# Altium schematic sheet USB_RC522_CARD_RW.SchDoc: USB RC522 Card Reader Writer
size A3; Author: eldar6776@hotmail.com; DrawnBy: Eldar Dedic; Organization: I-MEDIA GROUP d.o.o.; Address1: Osman Topal Paše 18; Address2: 71000 Sarajevo; Address3: Federacija BiH; Address4: Bosna i Hercegovina; DocumentNumber: DE-180716; Revision: 001; SheetNumber: 1; SheetTotal: 1; ProjectName: USB_RC522_CARD_RW
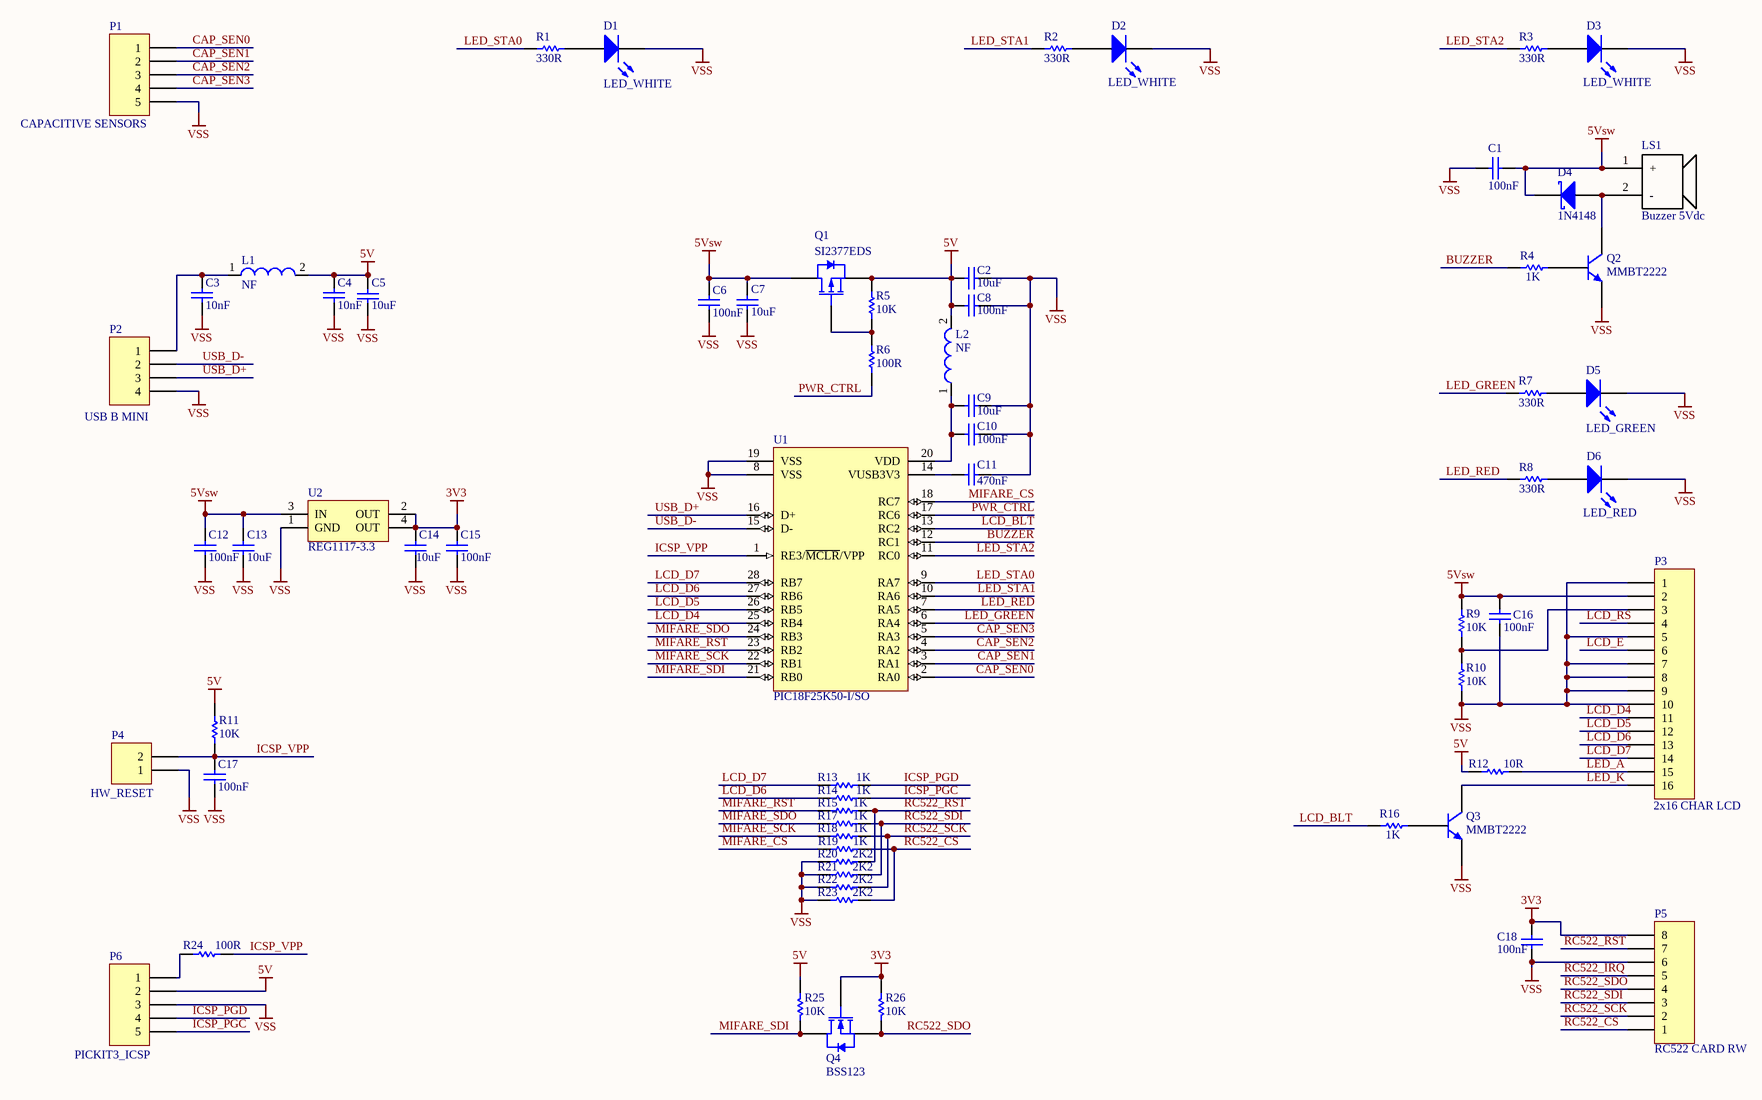
[diagram p0: USB_RC522_CARD_RW.SchDoc]

## Parts
C1  100nF  [0603]
C2  10uF  [0805]
C3  10nF  [0603]
C4  10nF  [0603]
C5  10uF  [0805]
C6  100nF  [0603]
C7  10uF  [0805]
C8  100nF  [0603]
C9  10uF  [0805]
C10  100nF  [0603]
C11  470nF  [0805]
C12  100nF  [0603]
C13  10uF  [0805]
C14  10uF  [0805]
C15  100nF  [0603]
C16  100nF  [0603]
C17  100nF  [0603]
C18  100nF  [0603]
D1  LED_WHITE  [1.6X0.8X0.8]
D2  LED_WHITE  [1.6X0.8X0.8]
D3  LED_WHITE  [1.6X0.8X0.8]
D4  1N4148  [SOD323]
D5  LED_GREEN  [1.6X0.8X0.8]
D6  LED_RED  [1.6X0.8X0.8]
L1  NF  [SMD-0805]
L2  NF  [SMD-0805]
LS1  Buzzer 5Vdc  [BUZZER]
P1  CAPACITIVE SENSORS  [HDR1X5]
P2  USB B MINI  [HDR1X4]
P3  2x16 CHAR LCD  [HDR1X16]
P4  HW_RESET  [HDR1X2]
P5  RC522 CARD RW  [HDR1X8]
P6  PICKIT3_ICSP  [HDR1X5]
Q1  SI2377EDS  [SOT23_N]
Q2  MMBT2222  [SOT23_N]
Q3  MMBT2222  [SOT23_N]
Q4  BSS123  [SOT23_N]
R1  330R  [ERA-0603]
R2  330R  [ERA-0603]
R3  330R  [ERA-0603]
R4  1K  [ERA-0603]
R5  10K  [ERA-0603]
R6  100R  [ERA-0603]
R7  330R  [ERA-0603]
R8  330R  [ERA-0603]
R9  10K  [ERA-0603]
R10  10K  [ERA-0603]
R11  10K  [ERA-0603]
R12  10R  [ERA-0603]
R13  1K  [ERA-0603]
R14  1K  [ERA-0603]
R15  1K  [ERA-0603]
R16  1K  [ERA-0603]
R17  1K  [ERA-0603]
R18  1K  [ERA-0603]
R19  1K  [ERA-0603]
R20  2K2  [ERA-0603]
R21  2K2  [ERA-0603]
R22  2K2  [ERA-0603]
R23  2K2  [ERA-0603]
R24  100R  [ERA-0603]
R25  10K  [ERA-0603]
R26  10K  [ERA-0603]
U1  PIC18F25K50-I/SO  [MCHP-SOIC-SO28_N]
U2  REG1117-3.3  [ZZ311]

## Nets
3V3: C14.2 C15.2 C18.1 P5.8 Q4.1(G) R26.2 U2.2(OUT) U2.4(OUT)
5V: C2.2 C4.1 C5.1 C8.2 L1.2 L2.2 P6.2 Q1.2(S) R5.1 R11.2 R12.2 R25.2
5Vsw: C1.1 C6.1 C7.1 C12.2 C13.2 C16.1 D4.1(K) LS1.1(+) P3.2 Q1.3(D) R9.1 U2.3(IN)
VSS: C1.2 C2.1 C3.2 C4.2 C5.2 C6.2 C7.2 C8.1 C9.1 C10.1 C11.1 C12.1 C13.1 C14.1 C15.1 C16.2 C17.2 C18.2 D1.2(K) D2.2(K) D3.2(K) D5.2(K) D6.2(K) P1.5 P2.4 P3.1 P3.5 P3.7 P3.8 P3.9 P3.10 P4.1 P5.6 P6.3 Q2.2(E) Q3.2(E) R10.2 R20.1 R21.1 R22.1 R23.1 U1.8(VSS) U1.19(VSS) U2.1(GND)
BUZZER: R4.1 U1.12(RC1)
CAP_SEN0: P1.1 U1.2(RA0)
CAP_SEN1: P1.2 U1.3(RA1)
CAP_SEN2: P1.3 U1.4(RA2)
CAP_SEN3: P1.4 U1.5(RA3)
ICSP_PGC: P6.5 R14.1
ICSP_PGD: P6.4 R13.1
ICSP_VPP: C17.1 P4.2 R11.1 R24.1 U1.1(RE3/~{MCLR}/VPP)
LCD_BLT: R16.1 U1.13(RC2)
LCD_D4: P3.11 U1.25(RB4)
LCD_D5: P3.12 U1.26(RB5)
LCD_D6: P3.13 R14.2 U1.27(RB6)
LCD_D7: P3.14 R13.2 U1.28(RB7)
LCD_E: P3.6
LCD_RS: P3.4
LED_A: P3.15 R12.1
LED_GREEN: R7.1 U1.6(RA4)
LED_K: P3.16 Q3.3(C)
LED_RED: R8.1 U1.7(RA5)
LED_STA0: R1.1 U1.9(RA7)
LED_STA1: R2.1 U1.10(RA6)
LED_STA2: R3.1 U1.11(RC0)
MIFARE_CS: R19.1 U1.18(RC7)
MIFARE_RST: R15.1 U1.23(RB2)
MIFARE_SCK: R18.1 U1.22(RB1)
MIFARE_SDI: Q4.3(D) R25.1 U1.21(RB0)
MIFARE_SDO: R17.1 U1.24(RB3)
PWR_CTRL: R6.2 U1.17(RC6)
RC522_CS: P5.1 R19.2 R23.2
RC522_IRQ: P5.5
RC522_RST: P5.7 R15.2 R20.2
RC522_SCK: P5.2 R18.2 R22.2
RC522_SDI: P5.3 R17.2 R21.2
RC522_SDO: P5.4 Q4.2(S) R26.1
USB_D+: P2.3 U1.16(D+)
USB_D-: P2.2 U1.15(D-)
NetC3_1: C3.1 L1.1 P2.1
NetC9_2: C9.2 C10.2 L2.1 U1.20(VDD)
NetC11_2: C11.2 U1.14(VUSB3V3)
NetD1_1: D1.1(A) R1.2
NetD2_1: D2.1(A) R2.2
NetD3_1: D3.1(A) R3.2
NetD4_2: D4.2(A) LS1.2(-) Q2.3(C)
NetD5_1: D5.1(A) R7.2
NetD6_1: D6.1(A) R8.2
NetP3_3: P3.3 R9.2 R10.1
NetP6_1: P6.1 R24.2
NetQ1_1: Q1.1(G) R5.2 R6.1
NetQ2_1: Q2.1(B) R4.2
NetQ3_1: Q3.1(B) R16.2

## Notes on the sheet
- Title
- Size:
- Date:
- A3
- Number:
- Time:
- Revision:
- Sheet
- of
- File:

## Library data of the parts
C1 C3 C4 C6 C8 C10 C12 C15-C18 = C0603: Ceramic Chip Capacitor - Standard; Note: Footprint corresponds to dimensions for bulk cassette packaging. This case size has tightened tolerances.; Published: 17-Jul-2002; LatestRevisionDate: 19-Mar-2004; LatestRevisionNote: Silkscreen size reduced.; DatasheetDocument: Mar-2001; PackageDocument: Mar-2001; PackageReference: 0603; Publisher: Altium Limited; Code_JEITA: 0603; Code_IPC: 1608 [0603]; ComponentLink1Description: Manufacturer Link; ComponentLink1URL: http://www.kemet.com/; ComponentLink2Description: Datasheet; ComponentLink2URL: http://www.kemet.com/kemet/web/homepage/kechome.nsf/vapubfilesname/F3102TA.pdf/$file/F3102TA.pdf
C2 C5 C7 C9 C11 C13 C14 = C0805: Ceramic Chip Capacitor - Standard; Note: Footprint corresponds to dimensions for bulk cassette packaging. This case size has tightened tolerances.; Published: 17-Jul-2002; LatestRevisionDate: 19-Mar-2004; LatestRevisionNote: Silkscreen size reduced.; DatasheetDocument: Mar-2001; PackageDocument: Mar-2001; PackageReference: 0805; Publisher: Altium Limited; Code_JEITA: 0805; Code_IPC: 2012[0805]; ComponentLink1Description: Manufacturer Link; ComponentLink1URL: http://www.kemet.com/; ComponentLink2Description: Datasheet; ComponentLink2URL: http://www.kemet.com/kemet/web/homepage/kechome.nsf/vapubfilesname/F3102TA.pdf/$file/F3102TA.pdf
D1-D3 D5 D6 = HSMZ-C190: High Performance Chip LED, Red; LuminousIntensity: 40mcd (Minimum).; PCB_Layout: Complies with manufacturer's recommendation.; Published: 11-Dec-2002; DatasheetDocument: 11-Mar-2002; PackageDocument: 11-Mar-2002; PackageReference: 1.6X0.8X0.8; Publisher: Altium Limited; LED_Colour: Red; ComponentLink1Description: Manufacturer Link; ComponentLink1URL: http://www.agilent.com/; ComponentLink2Description: Datasheet; ComponentLink2URL: http://cp.literature.agilent.com/litweb/pdf/5988-5891EN.pdf
D4 = 1PS76SB10: Schottky Barrier Diode; Published: 17-Sep-2003; LatestRevisionDate: 19-Mar-2004; LatestRevisionNote: Silkscreen size reduced.; DatasheetVersion: 14-Oct-1996; PackageVersion: May-1999; PackageReference: SOD323; Publisher: Altium Limited; PackageDescription: SOD-323/SC-76; 2 Leads; Body 1.7 x 1.3 mm, (LxW); ComponentLink1Description: Manufacturer Link; ComponentLink1URL: http://www.semiconductors.philips.com/; ComponentLink2Description: Datasheet; ComponentLink2URL: http://www.semiconductors.philips.com/acrobat/datasheets/1PS76SB10_2.pdf
L1 L2 = 744790282: SMD-Multilayer Inductor WE-MI, L = 8.20 µH; Inductance: 8.20 µH; DatasheetVersion: ver 1, May-2007; PackageVersion: 2005; PackageReference: SMD-0805; PackageDescription: Chip Inductor, 2-Leads, Body 2.0 x 1.2 mm; ComponentLink1Description: Manufacturer URL; ComponentLink1URL: http://www.we-online.com; ComponentLink2Description: Datasheet; ComponentLink2URL: http://www.we-online.de/katalog/media/pdf/744790282.pdf
LS1 = BUZZER: 5Vdc PCB buzzer
P1 P6 = Header 5: Header, 5-Pin; LatestRevisionDate: 17-Jul-2002; LatestRevisionNote: Re-released for DXP Platform.; Publisher: Altium Limited
P2 = Header 4: Header, 4-Pin; LatestRevisionDate: 17-Jul-2002; LatestRevisionNote: Re-released for DXP Platform.; Publisher: Altium Limited
P3 = Header 16: Header, 16-Pin; LatestRevisionDate: 17-Jul-2002; LatestRevisionNote: Re-released for DXP Platform.; Publisher: Altium Limited
P4 = Header 2: Header, 2-Pin; LatestRevisionDate: 17-Jul-2002; LatestRevisionNote: Re-released for DXP Platform.; Publisher: Altium Limited
P5 = Header 8: Header, 8-Pin; LatestRevisionDate: 17-Jul-2002; LatestRevisionNote: Re-released for DXP Platform.; Publisher: Altium Limited
Q1 = BSH203: P-channel Enhancement Mode MOSFET; Published: 17-Sep-2003; LatestRevisionDate: 12-Dec-2006; LatestRevisionNote: IPC-7351 Footprint Added.; DatasheetVersion: Aug-1998; PackageVersion: May-1999; PackageReference: SOT23; Publisher: Altium Limited; PackageDescription: 3-Pin SOT-23 Package 0.95 mm Pitch, 2.3 mm Lead Span; ComponentLink1Description: Manufacturer Link; ComponentLink1URL: http://www.semiconductors.philips.com/; ComponentLink2Description: Datasheet; ComponentLink2URL: http://www.semiconductors.philips.com/acrobat/datasheets/BSH203_3.pdf
Q2 Q3 = BC817: NPN General-purpose Transistor; Published: 17-Sep-2003; LatestRevisionDate: 12-Dec-2006; LatestRevisionNote: IPC-7351 Footprint Added.; DatasheetVersion: Jun-1999; PackageVersion: May-1999; PackageReference: SOT23; Publisher: Altium Limited; PackageDescription: 3-Pin SOT-23 Package 0.95 mm Pitch, 2.3 mm Lead Span; ComponentLink1Description: Manufacturer Link; ComponentLink1URL: http://www.semiconductors.philips.com/; ComponentLink2Description: Datasheet; ComponentLink2URL: http://www.semiconductors.philips.com/acrobat/datasheets/BC817_BC817W_BC337_5.pdf
Q4 = BSS123: N-channel Enhancement Mode Vertical D-MOSFET; Published: 17-Sep-2003; LatestRevisionDate: 12-Dec-2006; LatestRevisionNote: IPC-7351 Footprint Added.; DatasheetVersion: Apr-1995; PackageVersion: May-1999; PackageReference: SOT23; Publisher: Altium Limited; PackageDescription: 3-Pin SOT-23 Package 0.95 mm Pitch, 2.3 mm Lead Span; ComponentLink1Description: Manufacturer Link; ComponentLink1URL: http://www.semiconductors.philips.com/; ComponentLink2Description: Datasheet; ComponentLink2URL: http://www.semiconductors.philips.com/acrobat/datasheets/BSS123_3.pdf
R1-R26 = ERAV: Metal Film Thermosensitive Chip Resistor, 0.56 Ohm to 10k Ohm Range, 5% Tolerance, 0603 Size, 0.063 W; Note: If flow soldering, adjust pad width of PCB Footprint to 0.7 - 0.8 times the width of the resistor.; Published: 17-Dec-2003; LatestRevisionDate: 19-Mar-2004; LatestRevisionNote: Silkscreen size reduced.; PackageDocument: Mar-2003; PackageReference: ERA-0603; Publisher: Altium Limited; Code_IPC: 1608 [0603]; ComponentLink1Description: Manufacturer Link; ComponentLink1URL: http://www.panasonic.com/industrial/components/resistive_products.htm; ComponentLink2Description: Datasheet; ComponentLink2URL: http://www.panasonic.com/industrial/components/pdf/AOF0000CE1.pdf
U1 = PIC18F25K50-I/SO: Low-Power, High-Performance Microcontroller with XLP Technology, 48 MHz, 24 I/O, -40 to 85 degC, 28-pin SOIC (SO28), Tube; Manufacturer: Microchip; # of A/D Channels: 14; Digital Communication: 1 -A/E/USART, 1 -MSSP(SPI/I2C); EEPROM Data Memory (bytes): 256; I/O Pins: 24; Internal Oscillator: 16 MHz, 31 kHz; Max. CPU Speed MHz: 48; Memory Type: Flash; Operation Voltage Range: 1.8V - 5.5V; Program Memory KBytes: 32; Program Memory KWords: 16; RAM: 2048; Timers: 2 - 8-bit, 2 - 16-bit; DatasheetVersion: Rev. A; PackageVersion: C04-052C, 12/2012; PackageReference: SOIC-SO28; PackageDescription: 28-Lead Plastic Small Outline, 17.9 x 7.5 mm Body, 1.27 mm Pitch; Supplier 1: Digi-Key; Supplier Part Number 1: PIC18F25K50-I/SO-ND; Supplier 2: Farnell; Supplier Part Number 2: 2305831; Supplier 3: Newark; Supplier Part Number 3: 06W2972; Supplier 4: Mouser; Supplier Part Number 4: 579-PIC18F25K50-I/SO; Packing: TUBE; RoHS: TRUE; Mounting Technology: Surface Mount; PartNumber: PIC18F25K50-I/SO; ComponentLink1Description: Datasheet; ComponentLink1URL: http://ww1.microchip.com/downloads/en/DeviceDoc/30684A.pdf; ComponentLink2Description: Package Specification; ComponentLink2URL: http://www.microchip.com/stellent/groups/techpub_sg/documents/packagingspec/en012702.pdf; ComponentLink3Description: URL Link1; ComponentLink3URL: Product URL:http://www.microchip.com/datasheet/PIC18F25K50
U2 = REG1117-3.3: 800mA and 1A Low Dropout Positive Regulator 2.85V, 3.3V, 5V, and Adjustable; Published: 8-Jun-2000; LatestRevisionDate: 17-Jul-2002; LatestRevisionNote: Re-released for DXP Platform.; DatasheetVersion: Sep-1997; PackageVersion: revC; PackageReference: ZZ311; Publisher: Altium Limited; PackageDescription: SOT-223/SC-73; 4 Leads; Body 6.7 x 7.3 mm, inc. leads (LxW max); ComponentLink1Description: Manufacturer Link; ComponentLink1URL: http://www.ti.com/; ComponentLink2Description: Datasheet; ComponentLink2URL: http://www-s.ti.com/sc/ds/REG1117.pdf